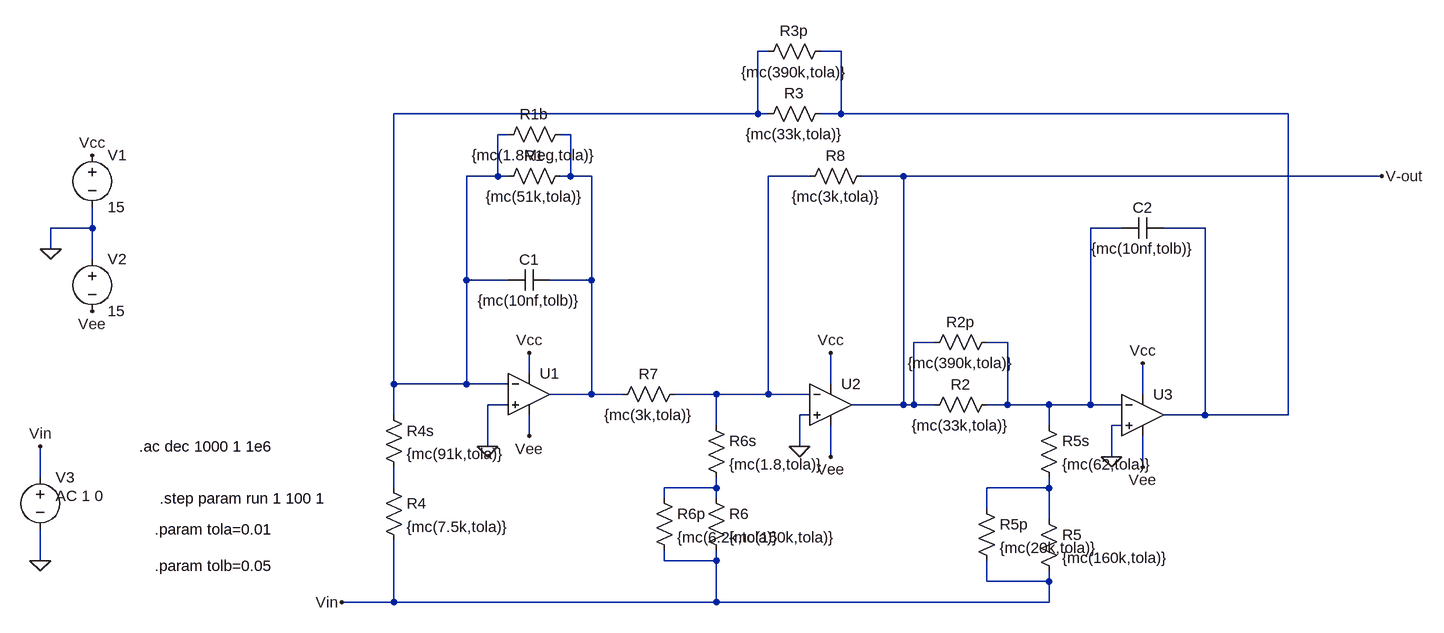
[diagram p0: schematic etapa 1.asc]
etapa 1.asc, the LTspice schematic file:
Version 4
SHEET 1 1672 680
WIRE 384 -624 368 -624
WIRE 496 -624 464 -624
WIRE 368 -528 368 -624
WIRE 368 -528 -192 -528
WIRE 384 -528 368 -528
WIRE 496 -528 496 -624
WIRE 496 -528 464 -528
WIRE 1184 -528 496 -528
WIRE -16 -496 -32 -496
WIRE 80 -496 64 -496
WIRE -32 -432 -32 -496
WIRE -32 -432 -80 -432
WIRE -16 -432 -32 -432
WIRE 80 -432 80 -496
WIRE 80 -432 64 -432
WIRE 112 -432 80 -432
WIRE 448 -432 384 -432
WIRE 592 -432 528 -432
WIRE 1328 -432 592 -432
WIRE -656 -352 -656 -384
WIRE -656 -352 -720 -352
WIRE 928 -352 880 -352
WIRE 1056 -352 992 -352
WIRE -720 -320 -720 -352
WIRE -656 -304 -656 -352
WIRE -80 -272 -80 -432
WIRE -16 -272 -80 -272
WIRE 112 -272 112 -432
WIRE 112 -272 48 -272
WIRE 640 -176 608 -176
WIRE 752 -176 720 -176
WIRE 16 -128 16 -160
WIRE -192 -112 -192 -528
WIRE -80 -112 -80 -272
WIRE -80 -112 -192 -112
WIRE -16 -112 -80 -112
WIRE 480 -112 480 -160
WIRE 112 -96 112 -272
WIRE 112 -96 48 -96
WIRE 160 -96 112 -96
WIRE 304 -96 240 -96
WIRE 384 -96 384 -432
WIRE 384 -96 304 -96
WIRE 448 -96 384 -96
WIRE 960 -96 960 -144
WIRE -16 -80 -48 -80
WIRE 592 -80 592 -432
WIRE 592 -80 512 -80
WIRE 608 -80 608 -176
WIRE 608 -80 592 -80
WIRE 640 -80 608 -80
WIRE 752 -80 752 -176
WIRE 752 -80 720 -80
WIRE 816 -80 752 -80
WIRE 880 -80 880 -352
WIRE 880 -80 816 -80
WIRE 928 -80 880 -80
WIRE -192 -64 -192 -112
WIRE 448 -64 432 -64
WIRE 1056 -64 1056 -352
WIRE 1056 -64 992 -64
WIRE 1184 -64 1184 -528
WIRE 1184 -64 1056 -64
WIRE 304 -48 304 -96
WIRE 816 -48 816 -80
WIRE 928 -48 912 -48
WIRE 16 -32 16 -64
WIRE -48 -16 -48 -80
WIRE 432 -16 432 -64
WIRE 480 0 480 -48
WIRE 912 0 912 -48
WIRE 960 16 960 -32
WIRE -736 32 -736 -16
WIRE -192 48 -192 16
WIRE 304 48 304 32
WIRE 304 48 224 48
WIRE 816 48 816 32
WIRE 816 48 720 48
WIRE 224 64 224 48
WIRE 304 64 304 48
WIRE 720 80 720 48
WIRE 816 96 816 48
WIRE -736 160 -736 112
WIRE 224 160 224 144
WIRE 304 160 304 144
WIRE 304 160 224 160
WIRE 720 192 720 160
WIRE 816 192 816 176
WIRE 816 192 720 192
WIRE -192 224 -192 128
WIRE -192 224 -272 224
WIRE 304 224 304 160
WIRE 304 224 -192 224
WIRE 816 224 816 192
WIRE 816 224 304 224
FLAG 912 0 0
FLAG 432 -16 0
FLAG 1328 -432 V-out
FLAG 16 -160 Vcc
FLAG 480 -160 Vcc
FLAG 960 -144 Vcc
FLAG 16 -32 Vee
FLAG 480 0 Vee
FLAG 960 16 Vee
FLAG -656 -464 Vcc
FLAG -656 -224 Vee
FLAG -720 -320 0
FLAG -736 160 0
FLAG -736 -16 Vin
FLAG -48 -16 0
FLAG -272 224 Vin
SYMBOL Opamps\\UniversalOpamp2 16 -96 R0
SYMATTR InstName U1
SYMATTR Value2 Avol=1000Meg GBW=10000Meg Slew=1000Meg
SYMATTR SpiceLine ilimit=50 rail=0 Vos=0 phimargin=45
SYMATTR SpiceLine2 en=0 enk=0 in=0 ink=0 Rin=100000Meg
SYMBOL Opamps\\UniversalOpamp2 480 -80 R0
SYMATTR InstName U2
SYMATTR Value2 Avol=1000Meg GBW=10000Meg Slew=1000Meg
SYMATTR SpiceLine ilimit=50 rail=0 Vos=0 phimargin=45
SYMATTR SpiceLine2 en=0 enk=0 in=0 ink=0 Rin=100000Meg
SYMBOL Opamps\\UniversalOpamp2 960 -64 R0
SYMATTR InstName U3
SYMATTR Value2 Avol=1000Meg GBW=10000Meg Slew=1000Meg
SYMATTR SpiceLine ilimit=50 rail=0 Vos=0 phimargin=45
SYMATTR SpiceLine2 en=0 enk=0 in=0 ink=0 Rin=100000Meg
SYMBOL res 80 -448 R90
WINDOW 0 0 56 VBottom 2
WINDOW 3 32 56 VTop 2
SYMATTR InstName R1
SYMATTR Value {mc(51k,tola)}
SYMBOL res 256 -112 R90
WINDOW 0 0 56 VBottom 2
WINDOW 3 32 56 VTop 2
SYMATTR InstName R7
SYMATTR Value {mc(3k,tola)}
SYMBOL res 736 -96 R90
WINDOW 0 0 56 VBottom 2
WINDOW 3 32 56 VTop 2
SYMATTR InstName R2
SYMATTR Value {mc(33k,tola)}
SYMBOL voltage -656 -480 R0
WINDOW 123 0 0 Left 2
WINDOW 39 0 0 Left 2
SYMATTR InstName V1
SYMATTR Value 15
SYMBOL voltage -656 -320 R0
WINDOW 123 0 0 Left 2
WINDOW 39 0 0 Left 2
SYMATTR InstName V2
SYMATTR Value 15
SYMBOL voltage -736 16 R0
WINDOW 123 24 44 Left 2
WINDOW 39 0 0 Left 2
SYMATTR Value2 AC 1 0
SYMATTR InstName V3
SYMATTR Value ""
SYMBOL cap 48 -288 R90
WINDOW 0 0 32 VBottom 2
WINDOW 3 32 32 VTop 2
SYMATTR InstName C1
SYMATTR Value {mc(10nf,tolb)}
SYMBOL res 480 -544 R90
WINDOW 0 0 56 VBottom 2
WINDOW 3 32 56 VTop 2
SYMATTR InstName R3
SYMATTR Value {mc(33k,tola)}
SYMBOL res 544 -448 R90
WINDOW 0 0 56 VBottom 2
WINDOW 3 32 56 VTop 2
SYMATTR InstName R8
SYMATTR Value {mc(3k,tola)}
SYMBOL cap 992 -368 R90
WINDOW 0 0 32 VBottom 2
WINDOW 3 32 32 VTop 2
SYMATTR InstName C2
SYMATTR Value {mc(10nf,tolb)}
SYMBOL res -208 32 R0
SYMATTR InstName R4
SYMATTR Value {mc(7.5k,tola)}
SYMBOL res 288 48 R0
SYMATTR InstName R6
SYMATTR Value {mc(150k,tola)}
SYMBOL res 800 80 R0
SYMATTR InstName R5
SYMATTR Value {mc(160k,tola)}
SYMBOL res 80 -512 R90
WINDOW 0 0 56 VBottom 2
WINDOW 3 32 56 VTop 2
SYMATTR InstName R1b
SYMATTR Value {mc(1.8Meg,tola)}
SYMBOL res 736 -192 R90
WINDOW 0 0 56 VBottom 2
WINDOW 3 32 56 VTop 2
SYMATTR InstName R2p
SYMATTR Value {mc(390k,tola)}
SYMBOL res 480 -640 R90
WINDOW 0 0 56 VBottom 2
WINDOW 3 32 56 VTop 2
SYMATTR InstName R3p
SYMATTR Value {mc(390k,tola)}
SYMBOL res -208 -80 R0
SYMATTR InstName R4s
SYMATTR Value {mc(91k,tola)}
SYMBOL res 704 64 R0
SYMATTR InstName R5p
SYMATTR Value {mc(20k,tola)}
SYMBOL res 800 -64 R0
SYMATTR InstName R5s
SYMATTR Value {mc(62,tola)}
SYMBOL res 208 48 R0
SYMATTR InstName R6p
SYMATTR Value {mc(6.2k,tola)}
SYMBOL res 288 -64 R0
SYMATTR InstName R6s
SYMATTR Value {mc(1.8,tola)}
TEXT -584 -16 Left 2 !.ac dec 1000 1 1e6
TEXT -552 64 Left 2 !.step param run 1 100 1
TEXT -560 112 Left 2 !.param tola=0.01
TEXT -560 168 Left 2 !.param tolb=0.05

The netlist it stands for:
* etapa 1.asc
XU1 0 N001 Vcc Vee N003 level.2 Avol=1000Meg GBW=10000Meg Slew=1000Meg ilimit=50 rail=0 Vos=0 phimargin=45 en=0 enk=0 in=0 ink=0 Rin=100000Meg  ; pins IN+ IN- V+ V- OUT
XU2 0 N004 Vcc Vee V-out level.2 Avol=1000Meg GBW=10000Meg Slew=1000Meg ilimit=50 rail=0 Vos=0 phimargin=45 en=0 enk=0 in=0 ink=0 Rin=100000Meg  ; pins IN+ IN- V+ V- OUT
XU3 0 N005 Vcc Vee N002 level.2 Avol=1000Meg GBW=10000Meg Slew=1000Meg ilimit=50 rail=0 Vos=0 phimargin=45 en=0 enk=0 in=0 ink=0 Rin=100000Meg  ; pins IN+ IN- V+ V- OUT
R1 N003 N001 {mc(51k,tola)}
R7 N004 N003 {mc(3k,tola)}
R2 N005 V-out {mc(33k,tola)}
V1 Vcc 0 15
V2 0 Vee 15
V3 Vin 0 AC 1 0
C1 N003 N001 {mc(10nf,tolb)}
R3 N002 N001 {mc(33k,tola)}
R8 V-out N004 {mc(3k,tola)}
C2 N002 N005 {mc(10nf,tolb)}
R4 N006 Vin {mc(7.5k,tola)}
R6 N007 Vin {mc(150k,tola)}
R5 N008 Vin {mc(160k,tola)}
R1b N003 N001 {mc(1.8Meg,tola)}
R2p N005 V-out {mc(390k,tola)}
R3p N002 N001 {mc(390k,tola)}
R4s N001 N006 {mc(91k,tola)}
R5p N008 Vin {mc(20k,tola)}
R5s N005 N008 {mc(62,tola)}
R6p N007 Vin {mc(6.2k,tola)}
R6s N004 N007 {mc(1.8,tola)}
.ac dec 1000 1 1e6
.step param run 1 100 1
.param tola=0.01
.param tolb=0.05
.lib UniversalOpamps2.sub
.backanno
.end